# Altium schematic sheet Cell_Balancing.SchDoc
size A; SheetNumber: 6; SheetTotal: 9
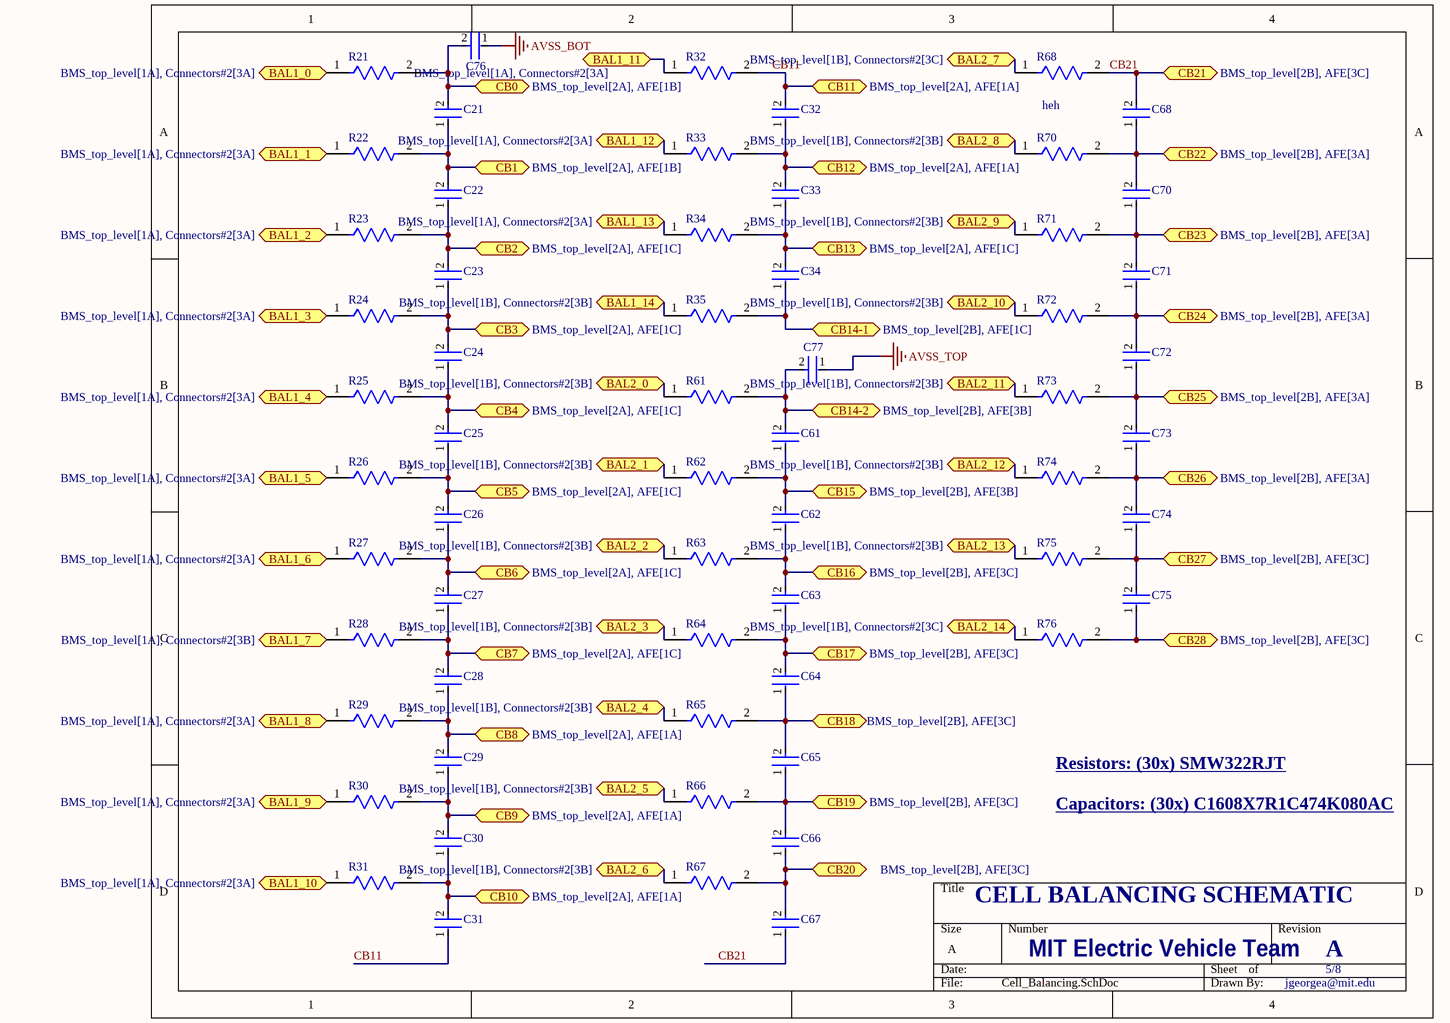
[diagram p0: Cell_Balancing.SchDoc]

## Parts
C21  C1608X7R1C474K080AC  [FP-C1608-080-0_1-IPC_C]  (value not drawn)
C22  C1608X7R1C474K080AC  [FP-C1608-080-0_1-IPC_C]  (value not drawn)
C23  C1608X7R1C474K080AC  [FP-C1608-080-0_1-IPC_C]  (value not drawn)
C24  C1608X7R1C474K080AC  [FP-C1608-080-0_1-IPC_C]  (value not drawn)
C25  C1608X7R1C474K080AC  [FP-C1608-080-0_1-IPC_C]  (value not drawn)
C26  C1608X7R1C474K080AC  [FP-C1608-080-0_1-IPC_C]  (value not drawn)
C27  C1608X7R1C474K080AC  [FP-C1608-080-0_1-IPC_C]  (value not drawn)
C28  C1608X7R1C474K080AC  [FP-C1608-080-0_1-IPC_C]  (value not drawn)
C29  C1608X7R1C474K080AC  [FP-C1608-080-0_1-IPC_C]  (value not drawn)
C30  C1608X7R1C474K080AC  [FP-C1608-080-0_1-IPC_C]  (value not drawn)
C31  C1608X7R1C474K080AC  [FP-C1608-080-0_1-IPC_C]  (value not drawn)
C32  C1608X7R1C474K080AC  [FP-C1608-080-0_1-IPC_C]  (value not drawn)
C33  C1608X7R1C474K080AC  [FP-C1608-080-0_1-IPC_C]  (value not drawn)
C34  C1608X7R1C474K080AC  [FP-C1608-080-0_1-IPC_C]  (value not drawn)
C61  C1608X7R1C474K080AC  [FP-C1608-080-0_1-IPC_C]  (value not drawn)
C62  C1608X7R1C474K080AC  [FP-C1608-080-0_1-IPC_C]  (value not drawn)
C63  C1608X7R1C474K080AC  [FP-C1608-080-0_1-IPC_C]  (value not drawn)
C64  C1608X7R1C474K080AC  [FP-C1608-080-0_1-IPC_C]  (value not drawn)
C65  C1608X7R1C474K080AC  [FP-C1608-080-0_1-IPC_C]  (value not drawn)
C66  C1608X7R1C474K080AC  [FP-C1608-080-0_1-IPC_C]  (value not drawn)
C67  C1608X7R1C474K080AC  [FP-C1608-080-0_1-IPC_C]  (value not drawn)
C68  C1608X7R1C474K080AC  [FP-C1608-080-0_1-IPC_C]  (value not drawn)
C70  C1608X7R1C474K080AC  [FP-C1608-080-0_1-IPC_C]  (value not drawn)
C71  C1608X7R1C474K080AC  [FP-C1608-080-0_1-IPC_C]  (value not drawn)
C72  C1608X7R1C474K080AC  [FP-C1608-080-0_1-IPC_C]  (value not drawn)
C73  C1608X7R1C474K080AC  [FP-C1608-080-0_1-IPC_C]  (value not drawn)
C74  C1608X7R1C474K080AC  [FP-C1608-080-0_1-IPC_C]  (value not drawn)
C75  C1608X7R1C474K080AC  [FP-C1608-080-0_1-IPC_C]  (value not drawn)
C76  C1608X7R1C474K080AC  [FP-C1608-080-0_1-IPC_C]  (value not drawn)
C77  C1608X7R1C474K080AC  [FP-C1608-080-0_1-IPC_C]  (value not drawn)
R21  SMW322RJT  [FP-SM_3-MFG]  (value not drawn)
R22  SMW322RJT  [FP-SM_3-MFG]  (value not drawn)
R23  SMW322RJT  [FP-SM_3-MFG]  (value not drawn)
R24  SMW322RJT  [FP-SM_3-MFG]  (value not drawn)
R25  SMW322RJT  [FP-SM_3-MFG]  (value not drawn)
R26  SMW322RJT  [FP-SM_3-MFG]  (value not drawn)
R27  SMW322RJT  [FP-SM_3-MFG]  (value not drawn)
R28  SMW322RJT  [FP-SM_3-MFG]  (value not drawn)
R29  SMW322RJT  [FP-SM_3-MFG]  (value not drawn)
R30  SMW322RJT  [FP-SM_3-MFG]  (value not drawn)
R31  SMW322RJT  [FP-SM_3-MFG]  (value not drawn)
R32  SMW322RJT  [FP-SM_3-MFG]  (value not drawn)
R33  SMW322RJT  [FP-SM_3-MFG]  (value not drawn)
R34  SMW322RJT  [FP-SM_3-MFG]  (value not drawn)
R35  SMW322RJT  [FP-SM_3-MFG]  (value not drawn)
R61  SMW322RJT  [FP-SM_3-MFG]  (value not drawn)
R62  SMW322RJT  [FP-SM_3-MFG]  (value not drawn)
R63  SMW322RJT  [FP-SM_3-MFG]  (value not drawn)
R64  SMW322RJT  [FP-SM_3-MFG]  (value not drawn)
R65  SMW322RJT  [FP-SM_3-MFG]  (value not drawn)
R66  SMW322RJT  [FP-SM_3-MFG]  (value not drawn)
R67  SMW322RJT  [FP-SM_3-MFG]  (value not drawn)
R68  SMW322RJT  [FP-SM_3-MFG]  (value not drawn)
R70  SMW322RJT  [FP-SM_3-MFG]  (value not drawn)
R71  SMW322RJT  [FP-SM_3-MFG]  (value not drawn)
R72  SMW322RJT  [FP-SM_3-MFG]  (value not drawn)
R73  SMW322RJT  [FP-SM_3-MFG]  (value not drawn)
R74  SMW322RJT  [FP-SM_3-MFG]  (value not drawn)
R75  SMW322RJT  [FP-SM_3-MFG]  (value not drawn)
R76  SMW322RJT  [FP-SM_3-MFG]  (value not drawn)

## Ports
BAL1_0 (bidir, see BMS_top_level[1A], Connectors#2[3A]), BAL1_1 (bidir, see BMS_top_level[1A], Connectors#2[3A]), BAL1_2 (bidir, see BMS_top_level[1A], Connectors#2[3A]), BAL1_3 (bidir, see BMS_top_level[1A], Connectors#2[3A]), BAL1_4 (bidir, see BMS_top_level[1A], Connectors#2[3A]), BAL1_5 (bidir, see BMS_top_level[1A], Connectors#2[3A]), BAL1_6 (bidir, see BMS_top_level[1A], Connectors#2[3A]), BAL1_7 (bidir, see BMS_top_level[1A], Connectors#2[3B]), BAL1_8 (bidir, see BMS_top_level[1A], Connectors#2[3A]), BAL1_9 (bidir, see BMS_top_level[1A], Connectors#2[3A]), BAL1_10 (bidir, see BMS_top_level[1A], Connectors#2[3A]), BAL1_11 (bidir, see BMS_top_level[1A], Connectors#2[3A]), BAL1_12 (bidir, see BMS_top_level[1A], Connectors#2[3A]), BAL1_13 (bidir, see BMS_top_level[1A], Connectors#2[3A]), BAL1_14 (bidir, see BMS_top_level[1B], Connectors#2[3B]), BAL2_0 (bidir, see BMS_top_level[1B], Connectors#2[3B]), BAL2_1 (bidir, see BMS_top_level[1B], Connectors#2[3B]), BAL2_2 (bidir, see BMS_top_level[1B], Connectors#2[3B]), BAL2_3 (bidir, see BMS_top_level[1B], Connectors#2[3B]), BAL2_4 (bidir, see BMS_top_level[1B], Connectors#2[3B]), BAL2_5 (bidir, see BMS_top_level[1B], Connectors#2[3B]), BAL2_6 (bidir, see BMS_top_level[1B], Connectors#2[3B]), BAL2_7 (bidir, see BMS_top_level[1B], Connectors#2[3C]), BAL2_8 (bidir, see BMS_top_level[1B], Connectors#2[3B]), BAL2_9 (bidir, see BMS_top_level[1B], Connectors#2[3B]), BAL2_10 (bidir, see BMS_top_level[1B], Connectors#2[3B]), BAL2_11 (bidir, see BMS_top_level[1B], Connectors#2[3B]), BAL2_12 (bidir, see BMS_top_level[1B], Connectors#2[3B]), BAL2_13 (bidir, see BMS_top_level[1B], Connectors#2[3B]), BAL2_14 (bidir, see BMS_top_level[1B], Connectors#2[3C]), CB0 (bidir, see BMS_top_level[2A], AFE[1B]), CB1 (bidir, see BMS_top_level[2A], AFE[1B]), CB2 (bidir, see BMS_top_level[2A], AFE[1C]), CB3 (bidir, see BMS_top_level[2A], AFE[1C]), CB4 (bidir, see BMS_top_level[2A], AFE[1C]), CB5 (bidir, see BMS_top_level[2A], AFE[1C]), CB6 (bidir, see BMS_top_level[2A], AFE[1C]), CB7 (bidir, see BMS_top_level[2A], AFE[1C]), CB8 (bidir, see BMS_top_level[2A], AFE[1A]), CB9 (bidir, see BMS_top_level[2A], AFE[1A]), CB10 (bidir, see BMS_top_level[2A], AFE[1A]), CB11 (bidir, see BMS_top_level[2A], AFE[1A]), CB12 (bidir, see BMS_top_level[2A], AFE[1A]), CB13 (bidir, see BMS_top_level[2A], AFE[1C]), CB14-1 (bidir, see BMS_top_level[2B], AFE[1C]), CB14-2 (bidir, see BMS_top_level[2B], AFE[3B]), CB15 (bidir, see BMS_top_level[2B], AFE[3B]), CB16 (bidir, see BMS_top_level[2B], AFE[3C]), CB17 (bidir, see BMS_top_level[2B], AFE[3C]), CB18 (bidir, see BMS_top_level[2B], AFE[3C]), CB19 (bidir, see BMS_top_level[2B], AFE[3C]), CB20 (bidir, see BMS_top_level[2B], AFE[3C]), CB21 (bidir, see BMS_top_level[2B], AFE[3C]), CB22 (bidir, see BMS_top_level[2B], AFE[3A]), CB23 (bidir, see BMS_top_level[2B], AFE[3A]), CB24 (bidir, see BMS_top_level[2B], AFE[3A]), CB25 (bidir, see BMS_top_level[2B], AFE[3A]), CB26 (bidir, see BMS_top_level[2B], AFE[3A]), CB27 (bidir, see BMS_top_level[2B], AFE[3C]), CB28 (bidir, see BMS_top_level[2B], AFE[3C])

## Nets
AVSS_BOT: C76.1
AVSS_TOP: C77.1
BAL1_0: R21.1 ; port BAL1_0
BAL1_1: R22.1 ; port BAL1_1
BAL1_2: R23.1 ; port BAL1_2
BAL1_3: R24.1 ; port BAL1_3
BAL1_4: R25.1 ; port BAL1_4
BAL1_5: R26.1 ; port BAL1_5
BAL1_6: R27.1 ; port BAL1_6
BAL1_7: R28.1 ; port BAL1_7
BAL1_8: R29.1 ; port BAL1_8
BAL1_9: R30.1 ; port BAL1_9
BAL1_10: R31.1 ; port BAL1_10
BAL1_11: R32.1 ; port BAL1_11
BAL1_12: R33.1 ; port BAL1_12
BAL1_13: R34.1 ; port BAL1_13
BAL1_14: R35.1 ; port BAL1_14
BAL2_0: R61.1 ; port BAL2_0
BAL2_1: R62.1 ; port BAL2_1
BAL2_2: R63.1 ; port BAL2_2
BAL2_3: R64.1 ; port BAL2_3
BAL2_4: R65.1 ; port BAL2_4
BAL2_5: R66.1 ; port BAL2_5
BAL2_6: R67.1 ; port BAL2_6
BAL2_7: R68.1 ; port BAL2_7
BAL2_8: R70.1 ; port BAL2_8
BAL2_9: R71.1 ; port BAL2_9
BAL2_10: R72.1 ; port BAL2_10
BAL2_11: R73.1 ; port BAL2_11
BAL2_12: R74.1 ; port BAL2_12
BAL2_13: R75.1 ; port BAL2_13
BAL2_14: R76.1 ; port BAL2_14
CB0: C21.2 C76.2 R21.2 ; port CB0
CB1: C21.1 C22.2 R22.2 ; port CB1
CB2: C22.1 C23.2 R23.2 ; port CB2
CB3: C23.1 C24.2 R24.2 ; port CB3
CB4: C24.1 C25.2 R25.2 ; port CB4
CB5: C25.1 C26.2 R26.2 ; port CB5
CB6: C26.1 C27.2 R27.2 ; port CB6
CB7: C27.1 C28.2 R28.2 ; port CB7
CB8: C28.1 C29.2 R29.2 ; port CB8
CB9: C29.1 C30.2 R30.2 ; port CB9
CB10: C30.1 C31.2 R31.2 ; port CB10
CB11: C31.1 C32.2 R32.2 ; port CB11
CB12: C32.1 C33.2 R33.2 ; port CB12
CB13: C33.1 C34.2 R34.2 ; port CB13
CB14-1: C34.1 R35.2 ; port CB14-1
CB14-2: C61.2 C77.2 R61.2 ; port CB14-2
CB15: C61.1 C62.2 R62.2 ; port CB15
CB16: C62.1 C63.2 R63.2 ; port CB16
CB17: C63.1 C64.2 R64.2 ; port CB17
CB18: C64.1 C65.2 R65.2 ; port CB18
CB19: C65.1 C66.2 R66.2 ; port CB19
CB20: C66.1 C67.2 R67.2 ; port CB20
CB21: C67.1 C68.2 R68.2 ; port CB21
CB22: C68.1 C70.2 R70.2 ; port CB22
CB23: C70.1 C71.2 R71.2 ; port CB23
CB24: C71.1 C72.2 R72.2 ; port CB24
CB25: C72.1 C73.2 R73.2 ; port CB25
CB26: C73.1 C74.2 R74.2 ; port CB26
CB27: C74.1 C75.2 R75.2 ; port CB27
CB28: C75.1 R76.2 ; port CB28

## Notes on the sheet
- heh
- Resistors: (30x) SMW322RJT
- Capacitors: (30x) C1608X7R1C474K080AC
- CELL BALANCING SCHEMATIC
- MIT Electric Vehicle Team
- A
- 5/8
- jgeorgea@mit.edu

## Library data of the parts
C21-C34 C61-C68 C70-C77 = CMP-08246-006173-1: Multilayer Ceramic Capacitors 470nF ±10% 16V X7R SMD 0603; REACH SVHC: No SVHC; Number of Pins: 2; Thickness: 0.037inch; Lead Free: Lead Free; Voltage: 16V; Case Code (Imperial): 0603; Capacitance: 470nF; Length: 1.6mm; Dielectric: X7R; Resistor Type: Ceramic; Weight: 7.1E-05oz; Termination: SMD/SMT; Radiation Hardening: No; RoHS Compliant: Yes; Dielectric Material: Ceramic; Case Code (Metric): 1608; Construction: Flat; Voltage Rating (DC): 16V; Package Quantity: 1; Mount: Surface Mount; Min Operating Temperature: -55°C; Case/Package: 0603; Series: C; Max Operating Temperature: 125°C; Depth: 0.8mm; Voltage Rating: 16V; Width: 0.031inch; Tolerance: 10%; Height: 0.8mm; Packaging: Tape and Reel
R21-R35 R61-R68 R70-R76 = CMP-03211-006031-1: RES SMD 22 OHM 5% 3W 4122; Manufacturer: TE connectivity; Resistance: 22Ω; Temperature Coefficient: 200ppm/°C; Value: 22Ω; Voltage Rating: 500V; Tolerance: 5%; Lead Free: Yes; Series: SM; ComponentLink2Description: Datasheet; Mouser Description: Wirewound Resistors - SMD 22    OHM  5%   3W; Device Class L3: Chip SMD Resistors; Device Class L1: Passive Components; Octopart: https://octopart.com/smw322rjt-te+connectivity-40971089; Device Class L2: Resistors; Height: 5.3mm; Automotive: No; Manufacturer Part Number: SMW322RJT; Power Rating: 3W; Temperature: -55°C to +200°C; Package: SM_3; Category: Res; RoHS: TRUE; Temperature Range High: +200°C; Temperature Range Low: -55°C; Digikey Description: RES SMD 22 OHM 5% 3W 4122; ComponentLink2URL: https://www.te.com/commerce/DocumentDelivery/DDEController?Action=showdoc&DocId=Data+Sheet%7F1773242%7FE%7Fpdf%7FEnglish%7FENG_DS_1773242_E.pdf%7F5-1879021-7; Composition: Wirewound